# EAGLE design sparkfun-9dof-razor-imu (EAGLE 7.7.0)
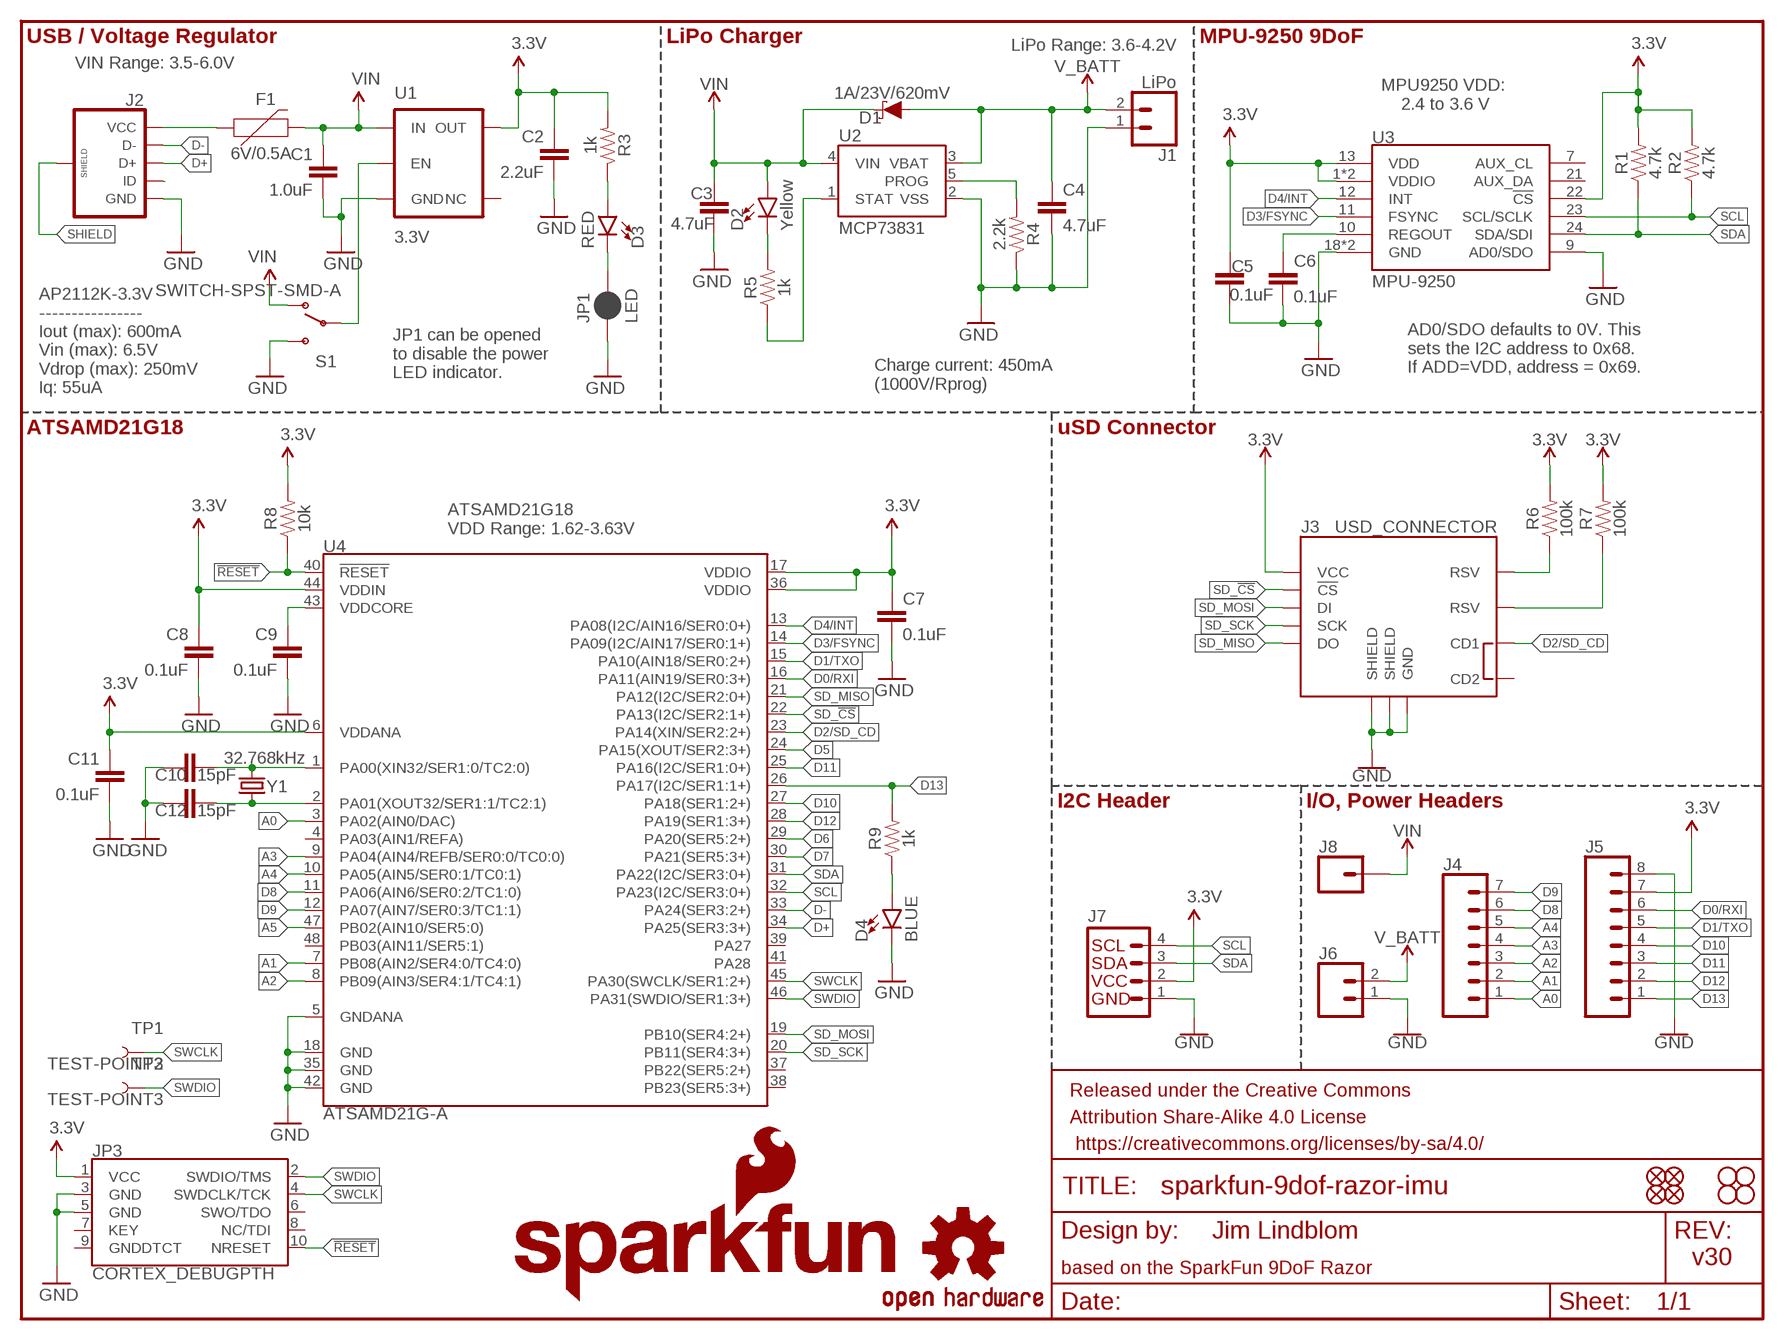
[diagram p0: schematic, sheet 1]

## Parts
C1  1.0uF  1.0UF-0603-16V-10%  [0603]
C2  2.2uF  2.2UF-0603-10V-20%  [0603]
C3  4.7uF  4.7UF0603  [0603]
C4  4.7uF  4.7UF0603  [0603]
C5  0.1uF  0.1UF-0603-25V-(+80/-20%)  [0603]
C6  0.1uF  0.1UF-0603-25V-(+80/-20%)  [0603]
C7  0.1uF  0.1UF-0603-25V-(+80/-20%)  [0603]
C8  0.1uF  0.1UF-0603-25V-(+80/-20%)  [0603]
C9  0.1uF  0.1UF-0603-25V-(+80/-20%)  [0603]
C10  15pF  15PF-0603-50V-5%  [0603]
C11  0.1uF  0.1UF-0603-100V-10%  [0603]
C12  15pF  15PF-0603-50V-5%  [0603]
D1  1A/23V/620mV  DIODE-SCHOTTKY-BAT20J  [SOD-323]
D2  Yellow  LED-YELLOW0603  [LED-0603]
D3  RED  LED-RED0603  [LED-0603]
D4  BLUE  LED-BLUE0603  [LED-0603]
F1  6V/0.5A  PPTC_HALF-AMP  [1206]
FD1  FIDUCIAL1X2  [FIDUCIAL-1X2]
FD2  FIDUCIAL1X2  [FIDUCIAL-1X2]
FD3  FIDUCIAL1X2  [FIDUCIAL-1X2]
FD4  FIDUCIAL1X2  [FIDUCIAL-1X2]
FRAME1  FRAME-LETTER  [CREATIVE_COMMONS]
H1  STAND-OFF  [STAND-OFF]
H2  STAND-OFF  [STAND-OFF]
H3  STAND-OFF  [STAND-OFF]
H4  STAND-OFF  [STAND-OFF]
J1  LiPo  CONN_02-JST-2MM-SMT  [JST-2-SMD]
J2  USB_MICROB_PLUGCONN-11752  [USB-B-MICRO-SMD_V03]
J3  USD_CONNECTOR  [MICRO-SD-SOCKET-PP]
J4  CONN_07  [1X07]
J5  CONN_08"  [1X08]
J6  CONN_02  [1X02]
J7  I2C_STANDARD  [1X04]
J8  CONN_01  [1X01]
JP1  LED  JUMPER-SMT_2_NC_PASTE_NO-SILK  [SMT-JUMPER_2_NC_PASTE_NO-SILK]
JP3  CORTEX_DEBUGPTH  [2X5-PTH-1.27MM]
LOGO1  SFE_LOGO_FLAME.1_INCH  [SFE_LOGO_FLAME_.1]
LOGO2  OSHW-LOGOS  [OSHW-LOGO-S]
LOGO3  SFE_LOGO_NAME.1_INCH  [SFE_LOGO_NAME_.1]
R1  4.7k  4.7KOHM-0603-1/10W-1%  [0603]
R2  4.7k  4.7KOHM-0603-1/10W-1%  [0603]
R3  1k  1KOHM-0603-1/10W-1%  [0603]
R4  2.2k  2.2KOHM-0603-1/10W-1%  [0603]
R5  1k  1KOHM-0603-1/10W-1%  [0603]
R6  100k  100KOHM-0603-1/10W-1%  [0603]
R7  100k  100KOHM-0603-1/10W-1%  [0603]
R8  10k  10KOHM-0603-1/10W-1%  [0603]
R9  1k  1KOHM-0603-1/10W-1%  [0603]
S1  SWITCH-SPST-SMD-A  SWITCH-SPDT-SMD-A  [SWITCH-SPST-SMD-A]
TP1  TEST-POINT3  [PAD.03X.03]
TP2  TEST-POINT3  [PAD.03X.03]
U1  3.3V  V_REG_AP2112K-3.3V  [SOT23-5]
U2  MCP73831  [SOT23-5]
U3  MPU-9250  [QFN24-3X3]
U4  ATSAMD21G-A  [TQFP-48]
Y1  32.768kHz  CRYSTAL-32.768KHZSMD-3.2X1.5  [CRYSTAL-SMD-3.2X1.5MM]

## Nets
3.3V: C2.1 C5.1 C7.1 C8.1 C11.1 J3.VCC J5.7 J7.2 JP3.1(VCC) R1.2 R2.2 R3.2 R6.2 R7.2 R8.2 U1.5(OUT) U3.1(VDDIO) U3.8(VDDIO) U3.13(VDD) U3.22(!CS) U4.6(VDDANA) U4.17(VDDIO) U4.36(VDDIO) U4.44(VDDIN)
!RESET: JP3.10(NRESET) R8.1 U4.40(!RESET!)
A0: J4.1 U4.3(PA02(AIN0/DAC))
A1: J4.2 U4.7(PB08(AIN2/SER4:0/TC4:0))
A2: J4.3 U4.8(PB09(AIN3/SER4:1/TC4:1))
A3: J4.4 U4.9(PA04(AIN4/REFB/SER0:0/TC0:0))
A4: J4.5 U4.10(PA05(AIN5/SER0:1/TC0:1))
A5: U4.47(PB02(AIN10/SER5:0))
CHG_LED: R5.1 U2.1(STAT)
D0/RXI: J5.6 U4.16(PA11(AIN19/SER0:3+))
D1/TXO: J5.5 U4.15(PA10(AIN18/SER0:2+))
D2/SD_CD: J3.CD1 U4.23(PA14(XIN/SER2:2+))
D3/FSYNC: U3.11(FSYNC) U4.14(PA09(I2C/AIN17/SER0:1+))
D4/INT: U3.12(INT) U4.13(PA08(I2C/AIN16/SER0:0+))
D5: U4.24(PA15(XOUT/SER2:3+))
D6: U4.29(PA20(SER5:2+))
D7: U4.30(PA21(SER5:3+))
D8: J4.6 U4.11(PA06(AIN6/SER0:2/TC1:0))
D9: J4.7 U4.12(PA07(AIN7/SER0:3/TC1:1))
D10: J5.4 U4.27(PA18(SER1:2+))
D11: J5.3 U4.25(PA16(I2C/SER1:0+))
D12: J5.2 U4.28(PA19(SER1:3+))
D13: J5.1 R9.2 U4.26(PA17(I2C/SER1:1+))
D+: J2.D+ U4.34(PA25(SER3:3+))
D-: J2.D- U4.33(PA24(SER3:2+))
GND: C1.2 C2.2 C3.2 C4.2 C5.2 C6.2 C7.2 C8.2 C9.2 C10.1 C11.2 C12.2 D4.C J1.1 J2.GND J3.GND J3.GND1(SHIELD) J3.GND3(SHIELD) J5.8 J6.1 J7.1 JP1.1 JP3.3(GND) JP3.5(GND) R4.1 S1.3(S) U1.2(GND) U2.2(VSS) U3.9(AD0/SDO) U3.18(GND) U3.20(GND) U4.5(GNDANA) U4.18(GND) U4.35(GND) U4.42(GND)
ID: J2.ID
N$1: F1.1 J2.VBUS(VCC)
N$2: C10.2 U4.1(PA00(XIN32/SER1:0/TC2:0)) Y1.P$2
N$3: D4.A R9.1
N$4: C12.1 U4.2(PA01(XOUT32/SER1:1/TC2:1)) Y1.P$1
N$5: D3.A R3.1
N$7: R4.2 U2.5(PROG)
N$8: J3.RSV1(RSV) R6.1
N$9: J3.RSV2(RSV) R7.1
N$11: D2.C R5.2
N$12: D3.C JP1.2
REGOUT: C6.1 U3.10(REGOUT)
SCL: J7.4 R2.1 U3.23(SCL/SCLK) U4.32(PA23(I2C/SER3:0+))
SD_!CS!: J3.CS(!CS) U4.22(PA13(I2C/SER2:1+))
SD_MISO: J3.DO U4.21(PA12(I2C/SER2:0+))
SD_MOSI: J3.DI U4.19(PB10(SER4:2+))
SD_SCK: J3.SCLK(SCK) U4.20(PB11(SER4:3+))
SDA: J7.3 R1.1 U3.24(SDA/SDI) U4.31(PA22(I2C/SER3:0+))
SHIELD: J2.SHIELD1(SHIELD) J2.SHIELD2(SHIELD) J2.SHIELD3(SHIELD)
SWCLK: JP3.4(SWDCLK/TCK) TP1.P$1 U4.45(PA30(SWCLK/SER1:2+))
SWDIO: JP3.2(SWDIO/TMS) TP2.P$1 U4.46(PA31(SWDIO/SER1:3+))
V_BATT: C4.1 D1.A J1.2 J6.2 U2.3(VBAT)
VDDCORE: C9.1 U4.43(VDDCORE)
VIN: C1.1 C3.1 D1.C D2.A F1.2 J8.1 S1.1(O) U1.1(IN) U2.4(VIN)
VREG_EN: S1.2(P) U1.3(EN)
Unconnected: J3.CD2 JP3.6(SWO/TDO) JP3.7(KEY) JP3.8(NC/TDI) JP3.9(GNDDTCT) U1.4(NC) U3.7(AUX_CL) U3.21(AUX_DA) U4.4(PA03(AIN1/REFA)) U4.37(PB22(SER5:2+)) U4.38(PB23(SER5:3+)) U4.39(PA27) U4.41(PA28) U4.48(PB03(AIN11/SER5:1))

## Notes on the sheet
- USB / Voltage Regulator | LiPo Charger | MPU-9250 9DoF
- LiPo Range: 3.6-4.2V
- VIN Range: 3.5-6.0V
- MPU9250 VDD:
   2.4 to 3.6 V
- AP2112K-3.3V
  ----------------
  Iout (max): 600mA 
  Vin (max): 6.5V
  Vdrop (max): 250mV
  Iq: 55uA
- AD0/SDO defaults to 0V. This 
  sets the I2C address to 0x68.
  If ADD=VDD, address = 0x69.
- JP1 can be opened
  to disable the power
  LED indicator.
- Charge current: 450mA
  (1000V/Rprog)
- ATSAMD21G18 | uSD Connector
- ATSAMD21G18
  VDD Range: 1.62-3.63V
- I2C Header | I/O, Power Headers
- Jim Lindblom
- v30
- based on the SparkFun 9DoF Razor

## Library data of the parts
C1 = SparkFun-Capacitors:1.0UF: 1µF ceramic capacitors A capacitor is a passive two-terminal electrical component used to store electrical energy temporarily in an electric field.; PROD_ID: CAP-00868
C2 = SparkFun-Capacitors:2.2UF: 2.2µF ceramic capacitors A capacitor is a passive two-terminal electrical component used to store electrical energy temporarily in an electric field.; PROD_ID: CAP-07888
C3 C4 = SparkFun-Capacitors:4.7UF: 4.7µF ceramic capacitors A capacitor is a passive two-terminal electrical component used to store electrical energy temporarily in an electric field.; PROD_ID: CAP-08280
C5-C9 = SparkFun-Capacitors:0.1UF: 0.1µF ceramic capacitors A capacitor is a passive two-terminal electrical component used to store electrical energy temporarily in an electric field.; PROD_ID: CAP-00810
C10 C12 = SparkFun-Capacitors:15PF: 15pF ceramic capacitors A capacitor is a passive two-terminal electrical component used to store electrical energy temporarily in an electric field.; PROD_ID: CAP-07881
C11 = SparkFun-Capacitors:0.1UF: 0.1µF ceramic capacitors A capacitor is a passive two-terminal electrical component used to store electrical energy temporarily in an electric field.; PROD_ID: CAP-08390
D1 = SparkFun-DiscreteSemi:DIODE-SCHOTTKY: Schottky diode A Schottky diode is a semiconductor diode which has a low forward voltage drop and a very fast switching action.; PROD_ID: DIO-11623
D2 = SparkFun-LED:LED-YELLOW: Yellow SMD LED Used in manufacturing several products at SparkFun. Packages: 0603 - SMD 0603 package[Product Link] <http://www.kingbrightusa.com/product.asp?catalog_name=LED&product_id=APT1608SYCK> 0603 -SMART - SMART SMD 0603 package (more efficient/more expensive) [Product Link] <http://www.osram-os.com/osram_os/en/products/product-catalog/led-light-emitting-diodes/smartled-0603/ly-l29k/index.jsp> LilyPad - SMD1206 package[Product Datasheet] <https://www.sparkfun.com/datasheets/DevTools/LilyPad/Q150YUS4.pdf> SparkFun Products: Blynk Board <https://www.sparkfun.com/products/13794> IOIO-OTG <https://www.sparkfun.com/products/13613> XBee Explorer Serial <https://www.sparkfun.com/products/13225>; PROD_ID: DIO-09003
D3 = SparkFun-LED:LED-RED: Red SMD LED Used in manufacturing of most products at SparkFun Packages: 0603 - SMD 0603 package [Product Link] <http://docs.avagotech.com/docs/AV02-0551EN> 0603 SMART - SMD 0603 SMART package ( more efficient and expensive)[Product Link] <http://www.osram-os.com/Graphics/XPic2/00077099_0.pdf> 1206 - SMD1206 package [Product Link] <https://www.sparkfun.com/datasheets/DevTools/LilyPad/Q150OVS4.pdff> SparkFun Products: Pro Mini 328 -5V <https://www.sparkfun.com/products/821> RedBoard <https://www.sparkfun.com/products/12757> IOIO-OTG <https://www.sparkfun.com/products/13613>; PROD_ID: DIO-00819
D4 = SparkFun-LED:LED-BLUE: Blue SMD LED Used in manufacturing of various products at SparkFun Packages: 0603 - SMD 0603 package [Product Link] <http://www.digikey.com/product-detail/en/SMLE12BC7TT86/511-1589-2-ND/1641808> 1206 - SMD1206 package [Product Link] <http://www.digikey.com/product-detail/en/lite-on-inc/LTST-C150TBKT/160-1643-1-ND/573584> SparkFun Products: ESP8266 Thing-Dev Board <https://www.sparkfun.com/products/13711> RedBoard <https://www.sparkfun.com/products/12757>; PROD_ID: DIO-08575
F1 = SparkFun-Fuses:PPTC: Resettable Fuse PPTC Resettable Fuse. Really a sort of resistor with a polymeric positive temperature coefficient whose resistance increases dramatically with an increase in temperature. When heated by the power passing through the resistance rises causing the current to be limited, protecting the circuit. This is achieved by the transition of the polymer from a crystalline to an amorphous state where the conductive carbon separates breaking the conductive pathways found in the cool crystalline structure. When a PPTC cools back down it resumes conducting letting the circuit turn back on. SparkFun Products: SparkFun RedBoard - Programmed with Arduino <https://www.sparkfun.com/products/12757> Pro Micro - 5V/16MHz <https://www.sparkfun.com/products/12640> Arduino Pro 328 - 5V/16MHz <https://www.sparkfun.com/products/10915> MP3 Trigger <https://www.sparkfun.com/products/13720>; PROD_ID: RES-08585
FD1-FD4 = SparkFun-Aesthetics:FIDUCIAL: Fiducial Alignment Points Point-of-reference for pick-and-place machines and other optical instruments.
FRAME1 = SparkFun-Aesthetics:FRAME-LETTER: Schematic Frame - Letter Standard 8.5x11 US Letter frame
H1-H4 = SparkFun-Electromechanical:STAND-OFF: #4 Stand Off This is the mechanical footprint for a #4 phillips button head screw. Use the keepout ring to avoid running the screw head into surrounding components. SKU : PRT-00447
J1 = SparkFun-Connectors:CONN_02: Multi connection point. Often used as Generic Header-pin footprint for 0.1 inch spaced/style header connections On any of the 0.1 inch spaced packages, you can populate with these: Break Away Headers - Straight <https://www.sparkfun.com/products/116> (PRT-00116) Break Away Male Headers - Right Angle <https://www.sparkfun.com/products/553> (PRT-00553) Female Headers <https://www.sparkfun.com/products/115> (PRT-00115) Break Away Headers - Machine Pin <https://www.sparkfun.com/products/117> (PRT-00117) Break Away Female Headers - Swiss Machine Pin <https://www.sparkfun.com/products/743> (PRT-00743) For SCREWTERMINALS and SPRING TERMINALS visit here: Screw Terimnals on SparkFun.com <https://www.sparkfun.com/search/results?term=Screw+Terminals> (5mm/3.5mm/2.54mm spacing) This device is also useful as a general connection point to wire up your design to another part of your project. Our various solder wires solder well into these plated through hole pads. Hook-Up Wire - Assortment (Stranded, 22 AWG) <https://www.sparkfun.com/products/11375> (PRT-11375) Hook-Up Wire - Assortment (Solid Core, 22 AWG) <https://www.sparkfun.com/products/11367> (PRT-11367) View the entire wire category on our website here <https://www.sparkfun.com/categories/141> Special notes: Molex polarized connector foot print use with: PRT-08233 with associated crimp pins and housings. 2.54_SCREWTERM for use with PRT-10571. 3.5mm Screw Terminal footprints for PRT-08084 5mm Screw Terminal footprints for use with PRT-08432; PROD_ID: CONN-11443
J2 = SparkFun-Connectors:USB_MICROB_PLUG: USB Micro-B connectors Some male, some female. Watch your step!; PROD_ID: CONN-11752
J3 = SparkFun-Connectors:USD_CONNECTOR: microSD Socket Push-push type µSD socket. Footprint production proven. Symbol has new and improved layout and naming accuracy. SparkFun Electronics SKU : PRT-00127. tDoc lines correctly indicate media card edge positions when inserting (unlocked, locked, depressed). NOTE: CD1 and CD2 are connected internally; PROD_ID: CONN-07820
J4 = SparkFun-Connectors:CONN_07: Multi connection point. Often used as Generic Header-pin footprint for 0.1 inch spaced/style header connections On any of the 0.1 inch spaced packages, you can populate with these: Break Away Headers - Straight <https://www.sparkfun.com/products/116> (PRT-00116) Break Away Male Headers - Right Angle <https://www.sparkfun.com/products/553> (PRT-00553) Female Headers <https://www.sparkfun.com/products/115> (PRT-00115) Break Away Headers - Machine Pin <https://www.sparkfun.com/products/117> (PRT-00117) Break Away Female Headers - Swiss Machine Pin <https://www.sparkfun.com/products/743> (PRT-00743) For SCREWTERMINALS and SPRING TERMINALS visit here: Screw Terimnals on SparkFun.com <https://www.sparkfun.com/search/results?term=Screw+Terminals> (5mm/3.5mm/2.54mm spacing) This device is also useful as a general connection point to wire up your design to another part of your project. Our various solder wires solder well into these plated through hole pads. Hook-Up Wire - Assortment (Stranded, 22 AWG) <https://www.sparkfun.com/products/11375> (PRT-11375) Hook-Up Wire - Assortment (Solid Core, 22 AWG) <https://www.sparkfun.com/products/11367> (PRT-11367) View the entire wire category on our website here <https://www.sparkfun.com/categories/141> Special notes: Molex polarized connector foot print use with SKU : PRT-08231 with associated crimp pins and housings. 1MM SMD Version SKU: PRT-10208 NOTES ON THE VARIANTS LOCK and LOCK_LONGPADS... This footprint was designed to help hold the alignment of a through-hole component (i.e. 6-pin header) while soldering it into place. You may notice that each hole has been shifted either up or down by 0.005 of an inch from it's more standard position (which is a perfectly straight line). This slight alteration caused the pins (the squares in the middle) to touch the edges of the holes. Because they are alternating, it causes a "brace" to hold the component in place. 0.005 has proven to be the perfect amount of "off-center" position when using our standard breakaway headers. Although looks a little odd when you look at the bare footprint, once you have a header in there, the alteration is very hard to notice. Also,if you push a header all the way into place, it is covered up entirely on the bottom side.
J5 = SparkFun-Connectors:CONN_08: Multi connection point. Often used as Generic Header-pin footprint for 0.1 inch spaced/style header connections On any of the 0.1 inch spaced packages, you can populate with these: Break Away Headers - Straight <https://www.sparkfun.com/products/116> (PRT-00116) Break Away Male Headers - Right Angle <https://www.sparkfun.com/products/553> (PRT-00553) Female Headers <https://www.sparkfun.com/products/115> (PRT-00115) Break Away Headers - Machine Pin <https://www.sparkfun.com/products/117> (PRT-00117) Break Away Female Headers - Swiss Machine Pin <https://www.sparkfun.com/products/743> (PRT-00743) For SCREWTERMINALS and SPRING TERMINALS visit here: Screw Terimnals on SparkFun.com <https://www.sparkfun.com/search/results?term=Screw+Terminals> (5mm/3.5mm/2.54mm spacing) This device is also useful as a general connection point to wire up your design to another part of your project. Our various solder wires solder well into these plated through hole pads. Hook-Up Wire - Assortment (Stranded, 22 AWG) <https://www.sparkfun.com/products/11375> (PRT-11375) Hook-Up Wire - Assortment (Solid Core, 22 AWG) <https://www.sparkfun.com/products/11367> (PRT-11367) View the entire wire category on our website here <https://www.sparkfun.com/categories/141> Special notes: Molex polarized connector foot print use with SKU : PRT-08231 with associated crimp pins and housings. 1MM SMD Version SKU: PRT-10208 NOTES ON THE VARIANTS LOCK and LOCK_LONGPADS... This footprint was designed to help hold the alignment of a through-hole component (i.e. 6-pin header) while soldering it into place. You may notice that each hole has been shifted either up or down by 0.005 of an inch from it's more standard position (which is a perfectly straight line). This slight alteration caused the pins (the squares in the middle) to touch the edges of the holes. Because they are alternating, it causes a "brace" to hold the component in place. 0.005 has proven to be the perfect amount of "off-center" position when using our standard breakaway headers. Although looks a little odd when you look at the bare footprint, once you have a header in there, the alteration is very hard to notice. Also,if you push a header all the way into place, it is covered up entirely on the bottom side.
J6 = SparkFun-Connectors:CONN_02: Multi connection point. Often used as Generic Header-pin footprint for 0.1 inch spaced/style header connections On any of the 0.1 inch spaced packages, you can populate with these: Break Away Headers - Straight <https://www.sparkfun.com/products/116> (PRT-00116) Break Away Male Headers - Right Angle <https://www.sparkfun.com/products/553> (PRT-00553) Female Headers <https://www.sparkfun.com/products/115> (PRT-00115) Break Away Headers - Machine Pin <https://www.sparkfun.com/products/117> (PRT-00117) Break Away Female Headers - Swiss Machine Pin <https://www.sparkfun.com/products/743> (PRT-00743) For SCREWTERMINALS and SPRING TERMINALS visit here: Screw Terimnals on SparkFun.com <https://www.sparkfun.com/search/results?term=Screw+Terminals> (5mm/3.5mm/2.54mm spacing) This device is also useful as a general connection point to wire up your design to another part of your project. Our various solder wires solder well into these plated through hole pads. Hook-Up Wire - Assortment (Stranded, 22 AWG) <https://www.sparkfun.com/products/11375> (PRT-11375) Hook-Up Wire - Assortment (Solid Core, 22 AWG) <https://www.sparkfun.com/products/11367> (PRT-11367) View the entire wire category on our website here <https://www.sparkfun.com/categories/141> Special notes: Molex polarized connector foot print use with: PRT-08233 with associated crimp pins and housings. 2.54_SCREWTERM for use with PRT-10571. 3.5mm Screw Terminal footprints for PRT-08084 5mm Screw Terminal footprints for use with PRT-08432
J7 = SparkFun-Connectors:I2C_STANDARD: SparkFun has standardized on a pinout for all I2C based sensor breakouts. This pinout allows I2C boards to be plugged directly into the headers on Arduino Uno compatible boards, and to be daisy chained easily.
J8 = SparkFun-Connectors:CONN_01: Single connection point. Often used as Generic Header-pin footprint for 0.1 inch spaced/style header connections On any of the 0.1 inch spaced packages, you can populate with these: Break Away Headers - Straight <https://www.sparkfun.com/products/116> (PRT-00116) Break Away Male Headers - Right Angle <https://www.sparkfun.com/products/553> (PRT-00553) Female Headers <https://www.sparkfun.com/products/115> (PRT-00115) Break Away Headers - Machine Pin <https://www.sparkfun.com/products/117> (PRT-00117) Break Away Female Headers - Swiss Machine Pin <https://www.sparkfun.com/products/743> (PRT-00743) This device is also useful as a general connection point to wire up your design to another part of your project. Our various solder wires solder well into these plated through hole pads. Hook-Up Wire - Assortment (Stranded, 22 AWG) <https://www.sparkfun.com/products/11375> (PRT-11375) Hook-Up Wire - Assortment (Solid Core, 22 AWG) <https://www.sparkfun.com/products/11367> (PRT-11367) View the entire wire category on our website here <https://www.sparkfun.com/categories/141> Special notes: SMTSO-256-ET is a "flush mount" nut for a 4-40 screw. We mostly use this on specialty testbeds; it is a nice way to connect hardware to your PCB at an adjustable hieght. Also note, the SNAP packages are for using a snappable style connector. We sell a baggie of snaps and they are also used on two LilyPad designs: Snap Assortment - 30 pack (male and female) <https://www.sparkfun.com/products/11347> (DEV-11347) LilyPad Arduino SimpleSnap <https://www.sparkfun.com/products/10941> (DEV-10941) LilyPad SimpleSnap Protoboard <https://www.sparkfun.com/products/10940> (DEV-10940)
JP1 = SparkFun-Jumpers:JUMPER-SMT_2_NC_PASTE: Normally closed solder jumper This jumper has an aperture in the stencil to allow solder paste to bridge the split in the wire so it's normally closed (NC). Wick off the solder to open the connection. Reapply solder to reclose the connection.
JP3 = samd21-temp:CORTEX_DEBUG: Cortex Debug Connector Datasheet <http://infocenter.arm.com/help/topic/com.arm.doc.faqs/attached/13634/cortex_debug_connectors.pdf>
LOGO1 = SparkFun-Aesthetics:SFE_LOGO_FLAME: SFE Logo, flame only This is the SparkFun flame logo. The logo on the schematic will always be the same size; the package variant is the height of the flame. Default layer for the logo on the board is tSilk.
LOGO2 = SparkFun-Aesthetics:OSHW-LOGO: Open Source Hardware Logo This logo indicates the piece of hardware it is found on incorporates a OSHW license and/or adheres to the definition of open source hardware found here: http://freedomdefined.org/OSHW
LOGO3 = SparkFun-Aesthetics:SFE_LOGO_NAME: SparkFun Font Logo This is the SparkFun name logo. The logo on the schematic will always be the same size; the package variant is the height of the flame part of the logo (or the height the flame would be, if it were drawn). Default layer for the logo on the board is tSilk.
R1 R2 = SparkFun-Resistors:4.7KOHM: 4.7kΩ resistor A resistor is a passive two-terminal electrical component that implements electrical resistance as a circuit element. Resistors act to reduce current flow, and, at the same time, act to lower voltage levels within circuits.; PROD_ID: RES-07857
R3 R5 R9 = SparkFun-Resistors:1KOHM: 1kΩ resistor A resistor is a passive two-terminal electrical component that implements electrical resistance as a circuit element. Resistors act to reduce current flow, and, at the same time, act to lower voltage levels within circuits.; PROD_ID: RES-07856
R4 = SparkFun-Resistors:2.2KOHM: 2.2kΩ resistor A resistor is a passive two-terminal electrical component that implements electrical resistance as a circuit element. Resistors act to reduce current flow, and, at the same time, act to lower voltage levels within circuits.; PROD_ID: RES-08272
R6 R7 = SparkFun-Resistors:100KOHM: 100kΩ resistor A resistor is a passive two-terminal electrical component that implements electrical resistance as a circuit element. Resistors act to reduce current flow, and, at the same time, act to lower voltage levels within circuits.; PROD_ID: RES-07828
R8 = SparkFun-Resistors:10KOHM: 10kΩ resistor A resistor is a passive two-terminal electrical component that implements electrical resistance as a circuit element. Resistors act to reduce current flow, and, at the same time, act to lower voltage levels within circuits.; PROD_ID: RES-00824
S1 = SparkFun-Electromechanical:SWITCH-SPDT: SPDT Switch Simple slide switch, Spark Fun Electronics SKU : COM-00102 DPDT SMT slide switch, AYZ0202, SWCH-08179; PROD_ID: SWCH-10651
TP1 TP2 = SparkFun-Connectors:TEST-POINT: Bare copper test points for troubleshooting or ICT
U1 = SparkFun-IC-Power:V_REG_AP2112: AP2112 - 600mA CMOS LDO Regulator w/ Enable The AP2112 is CMOS process low dropout linear regulator with enable function, the regulator delivers a guaranteed 600mA (min.) continuous load current. Features Output Voltage Accuracy: ±1.5% Output Current: 600mA (Min.) Foldback Short Current Protection: 50mA Enable Function to Turn ON/OFF VOUT Low Dropout Voltage (3.3V): 250mV (Typ.) @IOUT=600mA Excellent Load Regulation: 0.2%/A (Typ.) Excellent Line Regulation: 0.02%/V (Typ.) Low Quiescent Current: 55μA (Typ.) Low Standby Current: 0.01μA (Typ.) Low Output Noise: 50μVRMS PSRR: 100Hz -65dB, 1kHz -65dB OTSD Protection Stable with 1.0μF Flexible Cap: Ceramic, Tantalum and Aluminum Electrolytic Operation Temperature Range: -40°C to 85°C ESD: MM 400V, HBM 4000V; PROD_ID: VREG-12457
U2 = SparkFun-IC-Power:MCP73831: Miniature single cell, fully integrated Li-Ion, Li-polymer charge management controller http://ww1.microchip.com/downloads/en/DeviceDoc/20001984g.pdf IC-09995; PROD_ID: IC-09995
U3 = 9dof-devboard-temp:MPU-9250: NC pin 19. 2-6 & 14-17 not internally connected. May be used for PCB trace routing.; PROD_ID: IC-13192
U4 = SparkFun-IC-Microcontroller:ATSAMD21G: Atmel SAMD21G SMART ARM-Based Microcontroller The Atmel ® | SMART ™ SAM D21 is a series of low-power microcontrollers using the 32-bit ARM ® Cortex ® -M0+ processor, and ranging from 32- to 64-pins with up to 256KB Flash and 32KB of SRAM. The SAM D21 devices operate at a maximum frequency of 48MHz and reach 2.46 CoreMark/MHz. They are designed for simple and intuitive migration with identical peripheral modules, hex compatible code, identical linear address map and pin compatible migration paths between all devices in the product series. All devices include intelligent and flexible peripherals, Atmel Event System for inter-peripheral signaling, and support for capacitive touch button, slider and wheel user interfaces. Datasheet <https://cdn.sparkfun.com/datasheets/Dev/Arduino/Boards/Atmel-42181-SAM-D21_Datasheet.pdf> SparkFun Products SparkFun SAMD21 Mini Breakout <https://www.sparkfun.com/products/13664> (DEV-13664) SparkFun SAMD21 Dev Breakout <https://www.sparkfun.com/products/13672> (DEV-13672); PROD_ID: IC-13064
Y1 = SparkFun-Clocks:CRYSTAL-32.768KHZ: 32.768kHz Crystal Frequency: 32.768kHz Frequency Stability: ±20ppm Load Capacitance: 12.5pF (PTH-2X6 & SMD-3.2X1.5), 6pF (SMD-2X6); PROD_ID: XTAL-13062

## Board
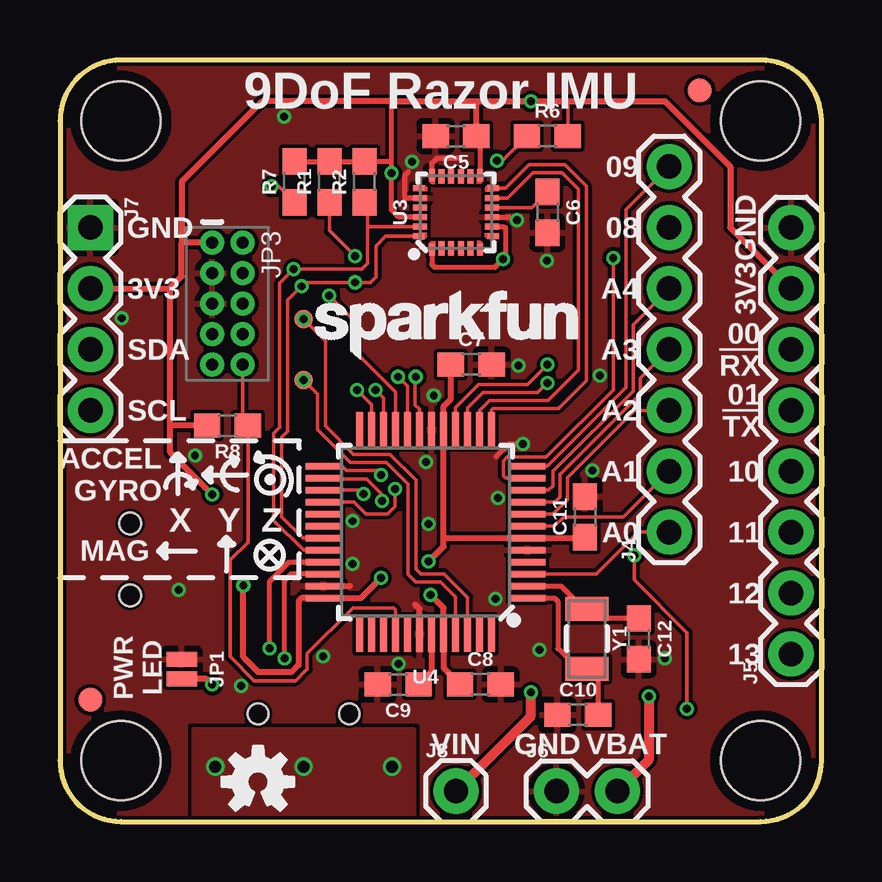
[diagram p1: board, top side]
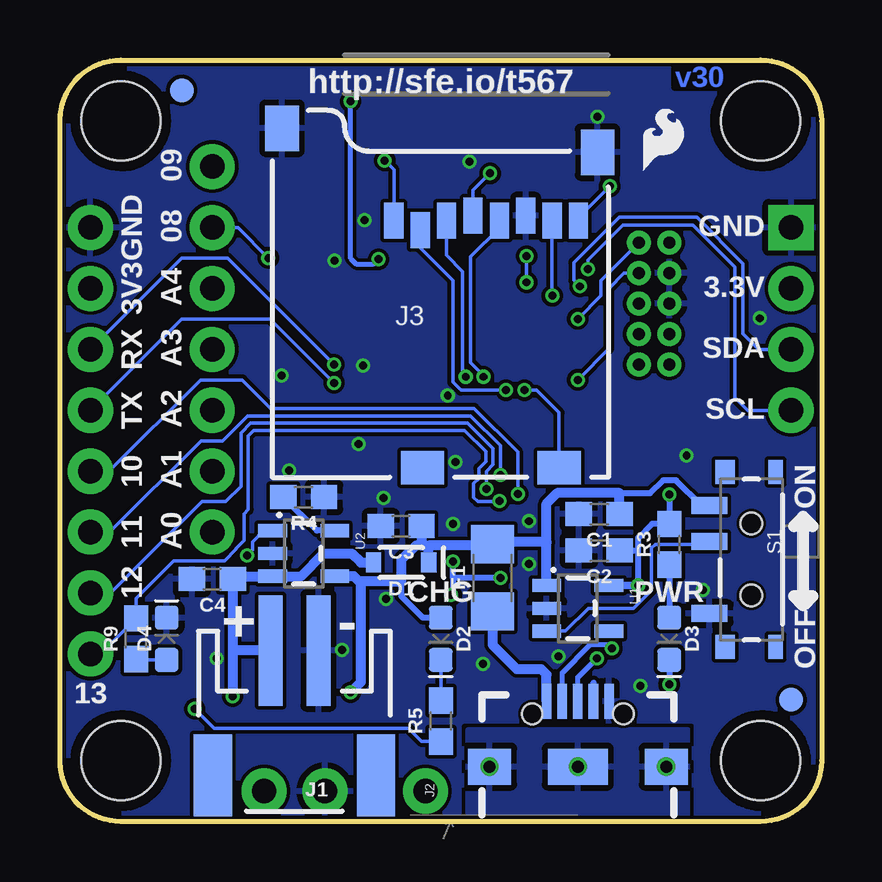
[diagram p2: board, bottom side, seen from below]

Size 31.75 x 31.75 mm. Coordinates in mm from the lower left corner, seen from the top.
Outline: 2.54,0 29.21,0 arc90 31.75,2.54 31.75,29.21 arc90 29.21,31.75 2.54,31.75 arc90 0,29.21 0,2.54 arc90 2.54,0
Copper layers (1*16): Top 0.035mm / dielectric 1.5mm / Bottom 0.035mm
Design rules "SparkFun-2-layer-FAB-LIMIT *": minimum track width 4mil, minimum drill 6mil, track to track 6mil, track to pad 6mil, pad to pad 6mil, via to via 6mil, smd to smd 6mil, copper to edge 4mil, drill to drill 4mil, minimum pad ring 5mil, minimum via ring 5mil, stop-mask expansion 4mil, vias tented up to drill 25mil, thermal gap 10mil

### Footprints (pad centres in the part's own frame; a part is rotated, then mirrored left to right if it is on the bottom)
0603 = smd 1.1 x 1: 1 -0.85,0; 2 0.85,0
SOD-323 = smd 0.63 x 0.83: A 1.15,0; C -1.15,0
LED-0603 = smd 1 x 1: A -0.877,0; C 0.877,0
1206 = smd 1.6 x 1.8: 1 -1.4,0; 2 1.4,0
FIDUCIAL-1X2 = smd 1 x 1: 1 0,0
STAND-OFF = hole 3.302: 0,0
JST-2-SMD = smd 1 x 4.6: 1 -1,-3.7; 2 1,-3.7 | smd 1.6 x 3.4: NC1 -3.4,1.5; NC2 3.4,1.5
USB-B-MICRO-SMD_V03 = smd 1.45 x 0.4: D+ 2.725,0; D- 2.725,0.65; GND 2.725,-1.3; ID 2.725,-0.65; VBUS 2.725,1.3 | smd 1.5 x 1.8: SHIELD1 0,3.685; SHIELD2 0,-3.685 | smd 1.5 x 2.5: SHIELD3 0,0 | hole 0.85: 2.2,1.9; 2.2,-1.9
MICRO-SD-SOCKET-PP = smd 1.8 x 1.4: CD1 -2.05,0.4; CD2 -7.75,0.4 | smd 0.8 x 1.5: CS -7.84,10.3; DI -6.74,10.7; DO -2.34,10.7; GND -3.44,10.9; RSV1 -8.94,10.7; RSV2 -1.24,10.7; SCLK -4.54,10.7; VCC -5.64,10.9 | smd 1.4 x 1.9: GND1 -13.6,14.55; GND3 -0.45,13.55
1X07 = drill 1.016 pad 1.88: 1 0,0; 2 2.54,0; 3 5.08,0; 4 7.62,0; 5 10.16,0; 6 12.7,0; 7 15.24,0
1X08 = drill 1.016 pad 1.88: 1 0,0; 2 2.54,0; 3 5.08,0; 4 7.62,0; 5 10.16,0; 6 12.7,0; 7 15.24,0; 8 17.78,0
1X02 = drill 1.016 pad 1.88: 1 0,0; 2 2.54,0
1X04 = drill 1.016 pad 1.88 square: 1 0,0 | drill 1.016 pad 1.88: 2 2.54,0; 3 5.08,0; 4 7.62,0
1X01 = drill 1.016 pad 1.88: 1 0,0
SMT-JUMPER_2_NC_PASTE_NO-SILK = smd 0.635 x 1.27: 1 -0.406,0; 2 0.406,0
2X5-PTH-1.27MM = drill 0.508 pad 1: 1 -2.54,-0.635; 2 -2.54,0.635; 3 -1.27,-0.635; 4 -1.27,0.635; 5 0,-0.635; 6 0,0.635; 7 1.27,-0.635; 8 1.27,0.635; 9 2.54,-0.635; 10 2.54,0.635
SWITCH-SPST-SMD-A = smd 0.7 x 1.5: 1 -2.25,-1.75; 2 -0.75,-1.75; 3 2.25,-1.75 | smd 1 x 0.6: GND1 -3.65,1; GND3 3.65,1 | smd 1 x 0.8: GND2 -3.65,-1.1; GND4 3.65,-1.1 | hole 0.9: -1.5,0; 1.5,0
PAD.03X.03 = smd 0.762 x 0.762: P$1 0,0
SOT23-5 = smd 0.55 x 1.2: 1 -0.95,-1.3; 2 0,-1.3; 3 0.95,-1.3; 4 0.95,1.3; 5 -0.95,1.3
QFN24-3X3 = smd 0.495 x 0.25: 1 -1.552,1; 6 -1.552,-1; 13 1.552,-1; 18 1.552,1 | smd 0.6 x 0.25: 2 -1.5,0.6; 3 -1.5,0.2; 4 -1.5,-0.2; 5 -1.5,-0.6; 14 1.5,-0.6; 15 1.5,-0.2; 16 1.5,0.2; 17 1.5,0.6 | smd 0.25 x 0.495: 7 -1,-1.552; 12 1,-1.552; 19 1,1.552; 24 -1,1.552 | smd 0.25 x 0.6: 8 -0.6,-1.5; 9 -0.2,-1.5; 10 0.2,-1.5; 11 0.6,-1.5; 20 0.6,1.5; 21 0.2,1.5; 22 -0.2,1.5; 23 -0.6,1.5
TQFP-48 = smd 1.5 x 0.28: 1 -4.25,2.75; 2 -4.25,2.25; 3 -4.25,1.75; 4 -4.25,1.25; 5 -4.25,0.75; 6 -4.25,0.25; 7 -4.25,-0.25; 8 -4.25,-0.75; 9 -4.25,-1.25; 10 -4.25,-1.75; 11 -4.25,-2.25; 12 -4.25,-2.75; 25 4.25,-2.75; 26 4.25,-2.25; 27 4.25,-1.75; 28 4.25,-1.25; 29 4.25,-0.75; 30 4.25,-0.25; 31 4.25,0.25; 32 4.25,0.75; 33 4.25,1.25; 34 4.25,1.75; 35 4.25,2.25; 36 4.25,2.75 | smd 0.28 x 1.5: 13 -2.75,-4.25; 14 -2.25,-4.25; 15 -1.75,-4.25; 16 -1.25,-4.25; 17 -0.75,-4.25; 18 -0.25,-4.25; 19 0.25,-4.25; 20 0.75,-4.25; 21 1.25,-4.25; 22 1.75,-4.25; 23 2.25,-4.25; 24 2.75,-4.25; 37 2.75,4.25; 38 2.25,4.25; 39 1.75,4.25; 40 1.25,4.25; 41 0.75,4.25; 42 0.25,4.25; 43 -0.25,4.25; 44 -0.75,4.25; 45 -1.25,4.25; 46 -1.75,4.25; 47 -2.25,4.25; 48 -2.75,4.25
CRYSTAL-SMD-3.2X1.5MM = smd 1 x 1.8: P$1 -1.25,0; P$2 1.25,0

### Placement (x,y rotation side)
C1  9.27,12.83 180 bottom
C2  9.27,11.3 180 bottom
C3  17.53,12.32 180 bottom
C4  25.4,10.11 180 bottom
C5  16.51,28.57 180 top
C6  20.32,25.4 270 top
C7  17.14,19.05 0 top
C8  17.53,5.71 0 top
C9  14.1,5.71 180 top
C10  21.59,4.45 0 top
C11  21.89,12.7 90 top
C12  24.13,7.62 270 top
D1  17.53,10.79 180 bottom
D2  15.88,7.62 270 bottom
D3  6.35,7.62 270 bottom
D4  27.3,7.62 90 bottom
F1  13.72,10.16 90 bottom
FD1  1.27,5.08 0 bottom
FD2  26.67,30.48 0 top
FD3  26.67,30.48 0 bottom
FD4  1.27,5.08 0 top
FRAME1  -16.51,-17.78 0 top  (outside the outline)
H1  29.21,2.54 0 top
H2  2.54,2.54 0 top
H3  29.21,29.21 0 top
H4  2.54,29.21 0 top
J1  21.97,3.43 180 bottom
J2  10.16,2.29 90 bottom
J3  8.89,14.35 0 bottom
J4  25.4,12.06 90 top
J5  30.48,6.99 90 top
J6  20.7,1.27 0 top
J7  1.27,24.77 270 top
J8  16.51,1.27 0 top
JP1  5.08,6.35 270 top
JP3  6.99,21.59 270 top
LOGO1  7.75,26.8 0 bottom
LOGO2  8.26,1.65 0 top
LOGO3  10.16,18.8 0 top
R1  11.24,26.67 90 top
R2  12.7,26.67 90 top
R3  6.35,11.56 90 bottom
R4  21.59,13.53 180 bottom
R5  15.88,4.19 90 bottom
R6  20.32,28.57 0 top
R7  9.78,26.67 90 top
R8  6.99,16.51 180 top
R9  28.57,7.62 90 bottom
S1  2.92,10.92 270 bottom
TP1  10.16,18.41 0 top
TP2  10.16,20.95 0 top
U1  10.16,8.89 270 bottom
U2  21.59,11.18 270 bottom
U3  16.51,25.4 90 top
U4  15.24,12.06 180 top
Y1  21.97,7.62 270 top

### Tracks (layer width: path | path; a pad name or v marks a point on that pad's centre or on a via)
3.3V  (via drill 0.33)
  Top 0.152: R6.2 21.17,30.02 21.59,30.02
  Top 0.203: U3.22 14.12,25.2 13.82,25.5 v13.82,27.03 13.82,27.53 | R7.2 R1.2 R2.2 12.71,27.53 13.82,27.53 | C5.1 17.51,28.43 U3.13 | 13.82,27.53 13.82,30.02 | U3.8 18.51,24.8 18.59,24.71 18.59,23.57 v18.47,23.44 18.14,23.11 15.62,23.11 15.51,23.23 U3.1
  Top 0.254: 15.99,11.81 U4.17 15.99,17.31 16.3,17.62 C7.1 15.99,19.05 | v7.64,9.84 7.64,6.86 8.28,6.22 9.65,6.22 9.96,6.53 9.96,9.2 10.08,9.31 U4.36 12.54,9.31 v13.39,10.16 | 5.08,24.13 5.08,26.67 8.43,30.02 13.82,30.02 17.36,30.02 | JP3.1 5.08,24.13 | 17.36,30.02 v19.63,30.02 21.59,30.02 25.22,30.02 27.94,27.3 27.94,24.77 J5.7 | C5.1 17.36,30.02 | 15.99,11.81 U4.6 21.86,11.81 C11.1 | v15.37,10.85 15.99,11.47 15.99,11.81 | v15.44,9.44 15.57,9.31 15.58,9.31 15.99,8.9 U4.44 15.99,6.4 C8.1 | 5.08,24.13 5.08,22.73 4.6,22.25 4.6,22.23 | 4.6,16.51 4.6,15.39 v6.35,13.64 | 4.6,16.51 4.6,22.23 | J7.2 4.6,22.23 | R8.2 4.6,16.51
  Bottom 0.152: J3.VCC 14.53,26.31 v13.82,27.03
  Bottom 0.203: v19.63,30.02 19.63,23.47 19.41,23.24 18.67,23.24 v18.47,23.44
  Bottom 0.254: v6.35,13.64 R3.2 7.06,12.41 7.64,11.82 7.64,11.3 | v13.39,10.16 15.37,10.16 | 15.37,10.16 v15.37,10.85 | v7.64,9.84 7.64,11.3 | C2.1 7.64,11.3 | 15.37,10.16 15.37,9.52 v15.44,9.44
  Bottom 0.305: U1.5 v7.64,9.84
!RESET
  Top 0.152: U4.40 13.99,8.82 13.9,8.91 12.21,8.91 10.31,7.01 10.31,6.36 9.81,5.87 8.1,5.87 7.09,6.88 7.09,10.9 7.83,11.64 R8.1 7.62,16.73 JP3.10
A0
  Top 0.152: J4.1 24.11,12.06 22.36,10.31 U4.3
A1
  Top 0.152: U4.7 20.62,12.31 21.01,12.7 23.5,12.7 J4.2
A2
  Top 0.152: U4.8 20.56,12.81 21.16,13.41 21.16,14.35 23.95,17.14 J4.3
A3
  Top 0.152: U4.9 20.63,13.31 20.85,13.54 20.85,14.48 24.21,17.83 24.21,18.49 J4.4
A4
  Top 0.152: U4.10 20.37,13.81 20.55,13.99 20.55,14.61 23.9,17.96 23.9,20.73 J4.5
CHG_LED  (via drill 0.33)
  Top 0.152: v26.14,4.7 26.14,7.87 23.94,10.07 v23.94,11.1
  Bottom 0.152: v26.14,4.7 25.32,3.89 17.22,3.89 16.68,3.34 R5.1 | v23.94,11.1 23.72,11.32 23.72,11.66 23.26,12.13 U2.1
D0/RXI  (via drill 0.33)
  Top 0.152: U4.16 16.49,17.25 17.45,18.21 19.48,18.21 v20.32,19.05
  Bottom 0.152: v20.32,19.05 24.77,23.5 26.67,23.5 J5.6
D1/TXO  (via drill 0.33)
  Top 0.152: U4.15 16.99,17.24 17.63,17.88 19.91,17.88 v20.32,18.29
  Bottom 0.152: v20.32,18.29 22.99,20.95 26.67,20.95 J5.5
D2/SD_CD  (via drill 0.33)
  Top 0.152: U4.23 12.99,17.38 v12.39,17.98
  Bottom 0.152: J3.CD1 10.94,17.04 11.88,17.98 v12.39,17.98
D3/FSYNC
  Top 0.152: U4.14 17.49,17.13 17.91,17.55 20.34,17.55 21.61,18.82 21.61,26.36 20.93,27.05 19.71,27.05 18.66,26 U3.11
D4/INT
  Top 0.152: U4.13 17.99,17.15 18.06,17.22 20.78,17.22 21.95,18.39 21.95,26.49 21.06,27.38 19.56,27.38 18.58,26.4 U3.12
D8  (via drill 0.33)
  Top 0.152: U4.11 18.58,14.31 18.49,14.4 18.49,15.04 18.64,15.19 20.27,15.19 23.06,17.98 v23.06,23.5
  Bottom 0.152: J4.6 24.33,24.77 v23.06,23.5
D9
  Top 0.152: U4.12 20.33,14.81 23.6,18.09 23.6,25.5 J4.7
D10  (via drill 0.33)
  Top 0.152: U4.27 12.5,13.81 v12.66,13.65
  Bottom 0.152: v12.66,13.65 12.66,15.4 14.48,17.22 22.96,17.22 24.16,18.41 25.88,18.41 29.69,14.61 J5.4
D11  (via drill 0.33)
  Top 0.152: U4.25 11.75,14.81 11.94,14.63 13.2,14.63 v13.39,14.44
  Bottom 0.152: J5.3 29.67,12.06 25.86,15.88 24.97,15.88 23.93,16.92 14.63,16.92 13.39,15.67 v13.39,14.44
D12  (via drill 0.33)
  Top 0.152: v13.97,13.87 13.97,13.14 13.66,12.83 12.75,12.83 12.26,13.31 U4.28
  Bottom 0.152: J5.2 29.64,9.53 25.83,13.34 24.84,13.34 24.21,13.97 24.21,16.2 23.8,16.61 14.76,16.61 13.69,15.54 13.69,14.88 13.97,14.6 v13.97,13.87
D13  (via drill 0.33)
  Top 0.152: v13.43,13.36 13.43,13.64 12.79,14.29 11.02,14.29 U4.26
  Bottom 0.152: v13.43,13.36 13.46,13.34 14.33,13.34 14.5,13.51 14.5,14.08 14.29,14.3 14.29,14.72 13.99,15.01 13.99,15.42 14.88,16.31 23.67,16.31 23.9,16.08 23.9,13.01 24.08,12.83 24.08,11.71 24.4,11.39 24.4,11.36 24.89,10.87 27,10.87 28.57,9.3 R9.2 30.06,6.99 J5.1
D+  (via drill 0.33)
  Top 0.203: v9.37,6.81 9.37,10.06 9.63,10.31 U4.34
  Bottom 0.203: J2.D+ 10.16,6.02 v9.37,6.81
D-  (via drill 0.33)
  Top 0.203: v8.74,7.21 8.74,10.01 9.54,10.81 U4.33
  Bottom 0.203: v8.74,7.21 8.89,7.37 9.65,7.37 10.81,6.21 J2.D-
GND  (via drill 0.33)
  Top 0.203: U3.9 18.74,25.2 | U3.18 15.51,27.45 15.72,27.66 16.59,27.66 | U3.20 14.39,26 14.38,26.01 14.38,26.95 14.53,27.1 | 18.19,15.21 18.72,15.75 v19.3,15.75
  Top 0.254: U4.42 14.99,8.86 14.81,9.04 | U4.35 12.08,9.81
  other vias: 12.19,10.74 15.37,12.41 14.68,27.51 19.05,25.07 19.99,7.16 9.35,29.39 18.15,9.28 20.29,23.39 15.25,14.99 2.58,20.98 5.63,15.27 12.19,12.52 22.2,14.64 18.26,13.49 7.54,5.66 10.97,6.88 4.94,9.66 14.12,6.57 25.22,6.79 15.58,17.77 19.11,19.01 22.5,18.59
  pour Bottom (isolate 0.152, rank 6): 31.75,0 31.75,31.75 0,31.75 0,0
  pour Top (isolate 0.152, rank 6): 0,0 0,31.75 31.75,31.75 31.75,0
ID
  Bottom 0.254: J2.ID 9.51,5.79
N$1
  Bottom 0.406: F1.1 13.72,7.37 12.7,6.35 11.68,6.35 11.46,6.13 J2.VBUS
N$2
  Top 0.203: U4.1 20.61,9.31 20.75,9.17 20.75,7.21 21.59,6.37 Y1.P$2 22.44,5.9 C10.2
N$3
  Bottom 0.152: D4.A 28.55,6.74 R9.1
N$4
  Top 0.203: U4.2 20.89,9.81 21.84,8.87 Y1.P$1 22.37,8.47 C12.1
N$5
  Bottom 0.254: R3.1 D3.A
N$7
  Bottom 0.254: U2.5 21.04,12.13 R4.2
N$8  (via drill 0.33)
  Top 0.152: R6.1 18.45,27.56 v18.21,27.56
  Bottom 0.152: J3.RSV1 17.83,27.18 v18.21,27.56
N$9  (via drill 0.33)
  Top 0.152: R7.1 9.11,26.49 v8.83,26.49
  Bottom 0.152: J3.RSV2 10.13,25.18 v8.83,26.49
N$11
  Bottom 0.152: R5.2 D2.C
N$12  (via drill 0.33)
  Top 0.254: v6.35,5.71 6.12,5.94 JP1.2
  Bottom 0.254: D3.C v6.35,5.71
REGOUT
  Top 0.152: U3.10 19.67,25.6 C6.1
SCL  (via drill 0.33)
  Top 0.152: U4.32 10.15,11.31 8.91,12.55 8.91,16.18 9.16,16.42 9.16,22.44 v9.74,23.02 12.59,23.02 12.83,23.27 12.83,24.8 | R2.1 12.7,25.71 12.83,25.59 12.83,24.8 | 12.83,24.8 U3.23
  Bottom 0.152: v9.74,23.02 9.74,23.41 8.28,24.87 5.36,24.87 3.61,23.11 3.61,17.68 3.07,17.14 J7.4
SD_!CS!  (via drill 0.33)
  Top 0.152: U4.22 13.49,17.65 v13.16,17.98
  Bottom 0.152: v13.16,17.98 15.04,17.98 15.37,18.31 15.37,22.55 16.73,23.92 J3.CS
SD_MISO  (via drill 0.33)
  Top 0.152: U4.21 13.99,17.91 12.37,19.53 12.37,20.78 v11.23,21.92
  Bottom 0.152: v11.23,21.92 J3.DO
SD_MOSI  (via drill 0.33)
  Top 0.152: U4.19 14.99,17.19 14.81,17.37 14.81,18.52 v14.83,18.54
  Bottom 0.152: v14.83,18.54 14.96,18.67 14.96,22.94 15.63,23.61 J3.DI
SD_SCK  (via drill 0.33)
  Top 0.152: U4.20 14.49,18.15 v14.1,18.54
  Bottom 0.152: v14.1,18.54 14.1,18.59 14.63,19.13 14.63,23.55 13.43,24.75 J3.SCLK
SDA  (via drill 0.33)
  Top 0.152: U4.31 10.13,11.81 9.25,12.7 9.25,16.03 9.49,16.27 9.49,21.73 v10.07,22.31 10.24,22.48 v12.29,22.48 12.95,22.48 13.17,22.7 13.17,23.99 13.58,24.4 U3.24 | R1.1 11.24,24.62 v12.29,23.57
  Bottom 0.152: J7.3 2.62,19.68 3.28,20.34 3.28,23.27 5.21,25.2 8.43,25.2 10.32,23.3 10.32,22.57 v10.07,22.31 | v12.29,22.48 v12.29,23.57
SHIELD  (via drill 0.51)
  other vias: 6.47,2.29 13.85,2.29 10.16,2.29
  pour Top (isolate 0.152): 5.59,3.81 5.59,0 14.73,0 14.73,3.81
  pour Bottom (isolate 0.152): 5.59,0 5.59,3.81 14.73,3.81 14.73,0
SWCLK  (via drill 0.33)
  Top 0.152: U4.45 16.49,9.37 15.86,9.99 14.82,9.99 14.51,10.31 14.51,14.08 13.61,14.98 12.11,14.98 10.74,16.34 10.74,17.83 TP1.P$1
  Bottom 0.152: JP3.4 8.23,22.86 8.87,22.23 8.87,19.71 TP1.P$1
  other vias: 10.16,18.41
SWDIO  (via drill 0.33)
  Top 0.152: U4.46 16.99,9.35 16.02,10.32 15.05,10.32 14.84,10.54 14.84,14.23 13.76,15.31 12.24,15.31 11.07,16.48 11.07,20.04 TP2.P$1
  Bottom 0.152: JP3.2 9.2,22.55 9.2,21.92 TP2.P$1
  other vias: 10.16,20.95
V_BATT  (via drill 0.33)
  Top 0.406: v24.55,5.22 24.55,2.58 J6.2
  Bottom 0.406: J1.2 24.55,7.13 | D1.A 19.2,10.79 19.58,11.18 20.75,11.18 21.7,10.23 U2.3 24.43,10.23 C4.1 24.55,7.13 | 24.55,7.13 v24.55,5.22
VDDCORE
  Top 0.254: U4.43 15.49,6.26 C9.1
VIN  (via drill 0.33)
  Top 0.406: J8.1 19.63,4.39 v19.63,5.38
  Bottom 0.254: 17.93,9.92 17.93,10.01 | D2.A 16.62,8.5 17.53,9.4 17.53,10.01 | 8.42,13.69 7.14,13.69 6.6,14.22 6.07,14.22 5.02,13.17 S1.1
  Bottom 0.406: U1.1 11.46,11.65 | 11.46,11.65 11.46,13.25 11.02,13.69 8.42,13.69 C1.1 | 16.38,11.51 13.77,11.51 F1.2 13.62,11.65 11.46,11.65 | 16.68,11.51 16.92,11.51 17.53,10.9 17.53,10.01 17.93,10.01 19.2,10.01 | 19.2,10.01 19.28,10.01 19.5,10.23 U2.4 | C3.1 16.68,11.51 | 16.68,11.51 16.38,11.51 | D1.C 16.38,11.51 | v19.63,5.38 19.2,5.82 19.2,10.01
VREG_EN
  Bottom 0.152: S1.2 4.79,11.56 6.93,11.56 7.09,11.4 7.09,9.64 7.84,8.89 9.73,8.89 10.68,7.94 U1.3

### Text on the board
Bottom: v30
tPlace: 9DoF Razor IMU | 09 | GND | 08 | GND | 3V3 | A4 | 3V3 | SDA | A3 | 00 / !RX | SCL | A2 | 01 / !TX | A1 | 10 | ACCEL / GYRO | X | Y | Z | A0 | 11 | MAG | 12 | 13 | PWR / LED | VIN | GND | VBAT
bPlace: http://sfe.io/t567 | 09 | GND | 08 | GND | 3.3V | A4 | 3V3 | SDA | A3 | RX | SCL | A2 | TX | A1 | 10 | ON | A0 | 11 | 12 | PWR | CHG | OFF | - | + | 13
Measures: Units in inches
tDocu: Jim Lindblom